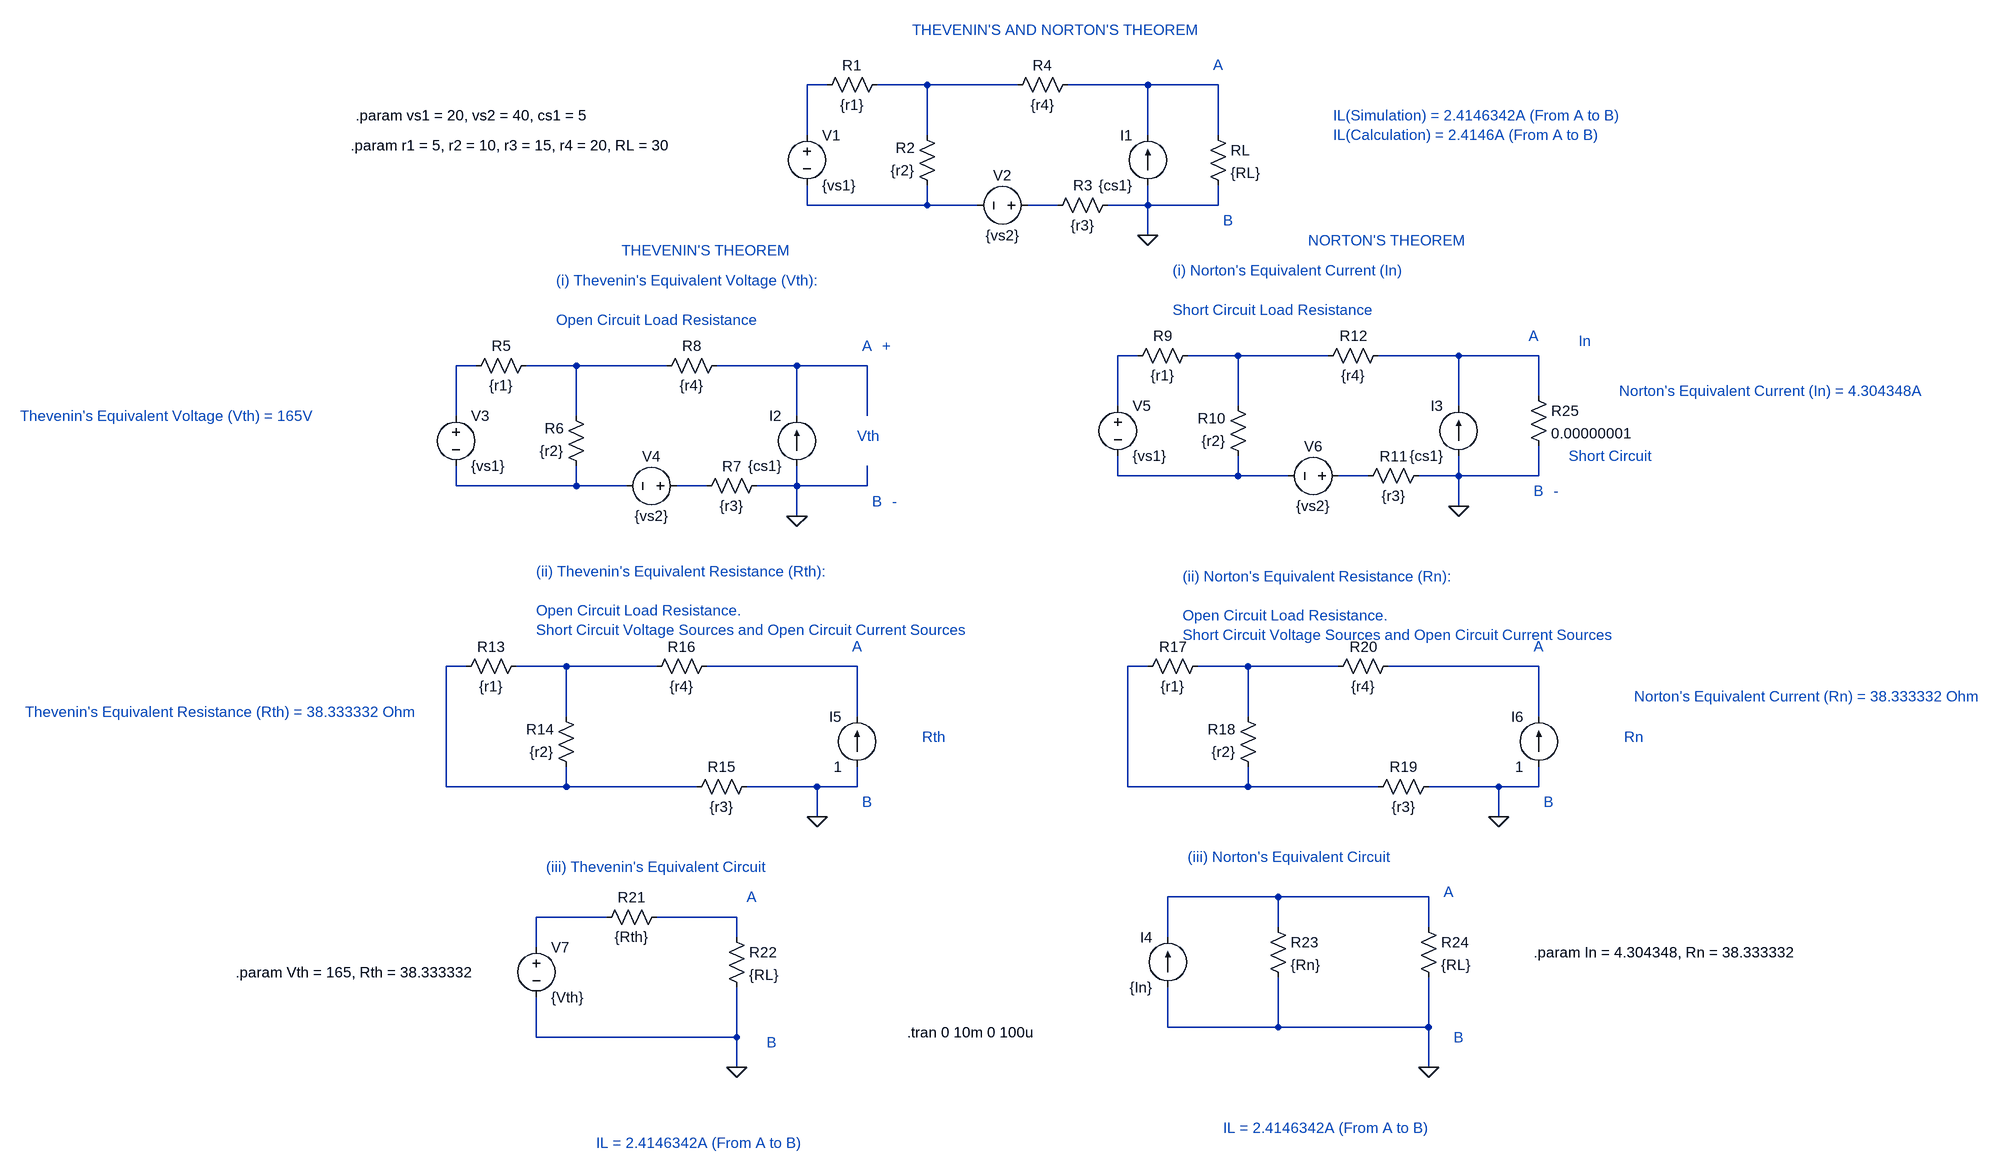
[diagram p0: schematic Thevenin's_Norton's_Theorem_2.asc]
Thevenin's_Norton's_Theorem_2.asc, the LTspice schematic file:
Version 4
SHEET 1 1732 1720
WIRE -160 16 -192 16
WIRE 0 16 -80 16
WIRE 144 16 0 16
WIRE 352 16 224 16
WIRE 464 16 352 16
WIRE -192 96 -192 16
WIRE 0 96 0 16
WIRE 352 96 352 16
WIRE 464 96 464 16
WIRE -192 208 -192 176
WIRE 0 208 0 176
WIRE 0 208 -192 208
WIRE 80 208 0 208
WIRE 208 208 160 208
WIRE 352 208 352 176
WIRE 352 208 288 208
WIRE 464 208 464 176
WIRE 464 208 352 208
WIRE 352 256 352 208
WIRE 336 448 304 448
WIRE 496 448 416 448
WIRE 640 448 496 448
WIRE 848 448 720 448
WIRE 976 448 848 448
WIRE -720 464 -752 464
WIRE -560 464 -640 464
WIRE -416 464 -560 464
WIRE -208 464 -336 464
WIRE -96 464 -208 464
WIRE 976 512 976 448
WIRE 304 528 304 448
WIRE 496 528 496 448
WIRE 848 528 848 448
WIRE -752 544 -752 464
WIRE -560 544 -560 464
WIRE -208 544 -208 464
WIRE -96 544 -96 464
WIRE 304 640 304 608
WIRE 496 640 496 608
WIRE 496 640 304 640
WIRE 576 640 496 640
WIRE 704 640 656 640
WIRE 848 640 848 608
WIRE 848 640 784 640
WIRE 976 640 976 592
WIRE 976 640 848 640
WIRE -752 656 -752 624
WIRE -560 656 -560 624
WIRE -560 656 -752 656
WIRE -480 656 -560 656
WIRE -352 656 -400 656
WIRE -208 656 -208 624
WIRE -208 656 -272 656
WIRE -96 656 -96 624
WIRE -96 656 -208 656
WIRE 848 688 848 640
WIRE -208 704 -208 656
WIRE -736 944 -768 944
WIRE -576 944 -656 944
WIRE -432 944 -576 944
WIRE -112 944 -352 944
WIRE 352 944 320 944
WIRE 512 944 432 944
WIRE 656 944 512 944
WIRE 976 944 736 944
WIRE -576 1024 -576 944
WIRE -112 1024 -112 944
WIRE 512 1024 512 944
WIRE 976 1024 976 944
WIRE -768 1136 -768 944
WIRE -576 1136 -576 1104
WIRE -576 1136 -768 1136
WIRE -368 1136 -576 1136
WIRE -176 1136 -288 1136
WIRE -112 1136 -112 1104
WIRE -112 1136 -176 1136
WIRE 320 1136 320 944
WIRE 512 1136 512 1104
WIRE 512 1136 320 1136
WIRE 720 1136 512 1136
WIRE 912 1136 800 1136
WIRE 976 1136 976 1104
WIRE 976 1136 912 1136
WIRE -176 1184 -176 1136
WIRE 912 1184 912 1136
WIRE 560 1312 384 1312
WIRE 800 1312 560 1312
WIRE -512 1344 -624 1344
WIRE -304 1344 -432 1344
WIRE 560 1360 560 1312
WIRE 800 1360 800 1312
WIRE -304 1376 -304 1344
WIRE 384 1376 384 1312
WIRE -624 1392 -624 1344
WIRE 384 1520 384 1456
WIRE 560 1520 560 1440
WIRE 560 1520 384 1520
WIRE 800 1520 800 1440
WIRE 800 1520 560 1520
WIRE -624 1536 -624 1472
WIRE -304 1536 -304 1456
WIRE -304 1536 -624 1536
WIRE -304 1584 -304 1536
WIRE 800 1584 800 1520
FLAG 352 256 0
FLAG -208 704 0
FLAG 848 688 0
FLAG -176 1184 0
FLAG 912 1184 0
FLAG -304 1584 0
FLAG 800 1584 0
SYMBOL voltage -192 80 R0
WINDOW 123 0 0 Left 0
WINDOW 39 0 0 Left 0
SYMATTR InstName V1
SYMATTR Value {vs1}
SYMBOL voltage 176 208 R90
WINDOW 0 -32 56 VBottom 2
WINDOW 3 32 56 VTop 2
WINDOW 123 0 0 Left 0
WINDOW 39 0 0 Left 0
SYMATTR InstName V2
SYMATTR Value {vs2}
SYMBOL current 352 176 R180
WINDOW 0 24 80 Left 2
WINDOW 3 24 0 Left 2
WINDOW 123 0 0 Left 0
WINDOW 39 0 0 Left 0
SYMATTR InstName I1
SYMATTR Value {cs1}
SYMBOL res -64 0 R90
WINDOW 0 0 56 VBottom 2
WINDOW 3 32 56 VTop 2
SYMATTR InstName R1
SYMATTR Value {r1}
SYMBOL res 16 192 R180
WINDOW 0 36 76 Left 2
WINDOW 3 36 40 Left 2
SYMATTR InstName R2
SYMATTR Value {r2}
SYMBOL res 192 224 R270
WINDOW 0 32 56 VTop 2
WINDOW 3 0 56 VBottom 2
SYMATTR InstName R3
SYMATTR Value {r3}
SYMBOL res 128 32 R270
WINDOW 0 32 56 VTop 2
WINDOW 3 0 56 VBottom 2
SYMATTR InstName R4
SYMATTR Value {r4}
SYMBOL res 448 80 R0
SYMATTR InstName RL
SYMATTR Value {RL}
SYMBOL voltage -752 528 R0
WINDOW 123 0 0 Left 0
WINDOW 39 0 0 Left 0
SYMATTR InstName V3
SYMATTR Value {vs1}
SYMBOL voltage -384 656 R90
WINDOW 0 -32 56 VBottom 2
WINDOW 3 32 56 VTop 2
WINDOW 123 0 0 Left 0
WINDOW 39 0 0 Left 0
SYMATTR InstName V4
SYMATTR Value {vs2}
SYMBOL current -208 624 R180
WINDOW 0 24 80 Left 2
WINDOW 3 24 0 Left 2
WINDOW 123 0 0 Left 0
WINDOW 39 0 0 Left 0
SYMATTR InstName I2
SYMATTR Value {cs1}
SYMBOL res -624 448 R90
WINDOW 0 0 56 VBottom 2
WINDOW 3 32 56 VTop 2
SYMATTR InstName R5
SYMATTR Value {r1}
SYMBOL res -544 640 R180
WINDOW 0 36 76 Left 2
WINDOW 3 36 40 Left 2
SYMATTR InstName R6
SYMATTR Value {r2}
SYMBOL res -368 672 R270
WINDOW 0 32 56 VTop 2
WINDOW 3 0 56 VBottom 2
SYMATTR InstName R7
SYMATTR Value {r3}
SYMBOL res -432 480 R270
WINDOW 0 32 56 VTop 2
WINDOW 3 0 56 VBottom 2
SYMATTR InstName R8
SYMATTR Value {r4}
SYMBOL voltage 304 512 R0
WINDOW 123 0 0 Left 0
WINDOW 39 0 0 Left 0
SYMATTR InstName V5
SYMATTR Value {vs1}
SYMBOL voltage 672 640 R90
WINDOW 0 -32 56 VBottom 2
WINDOW 3 32 56 VTop 2
WINDOW 123 0 0 Left 0
WINDOW 39 0 0 Left 0
SYMATTR InstName V6
SYMATTR Value {vs2}
SYMBOL current 848 608 R180
WINDOW 0 24 80 Left 2
WINDOW 3 24 0 Left 2
WINDOW 123 0 0 Left 0
WINDOW 39 0 0 Left 0
SYMATTR InstName I3
SYMATTR Value {cs1}
SYMBOL res 432 432 R90
WINDOW 0 0 56 VBottom 2
WINDOW 3 32 56 VTop 2
SYMATTR InstName R9
SYMATTR Value {r1}
SYMBOL res 512 624 R180
WINDOW 0 36 76 Left 2
WINDOW 3 36 40 Left 2
SYMATTR InstName R10
SYMATTR Value {r2}
SYMBOL res 688 656 R270
WINDOW 0 32 56 VTop 2
WINDOW 3 0 56 VBottom 2
SYMATTR InstName R11
SYMATTR Value {r3}
SYMBOL res 624 464 R270
WINDOW 0 32 56 VTop 2
WINDOW 3 0 56 VBottom 2
SYMATTR InstName R12
SYMATTR Value {r4}
SYMBOL res -640 928 R90
WINDOW 0 0 56 VBottom 2
WINDOW 3 32 56 VTop 2
SYMATTR InstName R13
SYMATTR Value {r1}
SYMBOL res -560 1120 R180
WINDOW 0 36 76 Left 2
WINDOW 3 36 40 Left 2
SYMATTR InstName R14
SYMATTR Value {r2}
SYMBOL res -384 1152 R270
WINDOW 0 32 56 VTop 2
WINDOW 3 0 56 VBottom 2
SYMATTR InstName R15
SYMATTR Value {r3}
SYMBOL res -448 960 R270
WINDOW 0 32 56 VTop 2
WINDOW 3 0 56 VBottom 2
SYMATTR InstName R16
SYMATTR Value {r4}
SYMBOL res 448 928 R90
WINDOW 0 0 56 VBottom 2
WINDOW 3 32 56 VTop 2
SYMATTR InstName R17
SYMATTR Value {r1}
SYMBOL res 528 1120 R180
WINDOW 0 36 76 Left 2
WINDOW 3 36 40 Left 2
SYMATTR InstName R18
SYMATTR Value {r2}
SYMBOL res 704 1152 R270
WINDOW 0 32 56 VTop 2
WINDOW 3 0 56 VBottom 2
SYMATTR InstName R19
SYMATTR Value {r3}
SYMBOL res 640 960 R270
WINDOW 0 32 56 VTop 2
WINDOW 3 0 56 VBottom 2
SYMATTR InstName R20
SYMATTR Value {r4}
SYMBOL voltage -624 1376 R0
WINDOW 123 0 0 Left 0
WINDOW 39 0 0 Left 0
SYMATTR InstName V7
SYMATTR Value {Vth}
SYMBOL res -416 1328 R90
WINDOW 0 0 56 VBottom 2
WINDOW 3 32 56 VTop 2
SYMATTR InstName R21
SYMATTR Value {Rth}
SYMBOL res -320 1360 R0
SYMATTR InstName R22
SYMATTR Value {RL}
SYMBOL current 384 1456 R180
WINDOW 0 24 80 Left 2
WINDOW 3 24 0 Left 2
WINDOW 123 0 0 Left 0
WINDOW 39 0 0 Left 0
SYMATTR InstName I4
SYMATTR Value {In}
SYMBOL res 544 1344 R0
SYMATTR InstName R23
SYMATTR Value {Rn}
SYMBOL res 784 1344 R0
SYMATTR InstName R24
SYMATTR Value {RL}
SYMBOL current -112 1104 R180
WINDOW 0 24 80 Left 2
WINDOW 3 24 0 Left 2
WINDOW 123 0 0 Left 0
WINDOW 39 0 0 Left 0
SYMATTR InstName I5
SYMATTR Value 1
SYMBOL current 976 1104 R180
WINDOW 0 24 80 Left 2
WINDOW 3 24 0 Left 2
WINDOW 123 0 0 Left 0
WINDOW 39 0 0 Left 0
SYMATTR InstName I6
SYMATTR Value 1
SYMBOL res 960 496 R0
SYMATTR InstName R25
SYMATTR Value 0.00000001
TEXT -24 -72 Left 2 ;THEVENIN'S AND NORTON'S THEOREM
TEXT -488 280 Left 2 ;THEVENIN'S THEOREM
TEXT 608 264 Left 2 ;NORTON'S THEOREM
TEXT -592 328 Left 2 ;(i) Thevenin's Equivalent Voltage (Vth):\n \nOpen Circuit Load Resistance
TEXT -624 792 Left 2 ;(ii) Thevenin's Equivalent Resistance (Rth):\n \nOpen Circuit Load Resistance.\nShort Circuit Voltage Sources and Open Circuit Current Sources
TEXT 392 312 Left 2 ;(i) Norton's Equivalent Current (In)\n \nShort Circuit Load Resistance
TEXT 408 800 Left 2 ;(ii) Norton's Equivalent Resistance (Rn):\n \nOpen Circuit Load Resistance.\nShort Circuit Voltage Sources and Open Circuit Current Sources
TEXT -608 1264 Left 2 ;(iii) Thevenin's Equivalent Circuit
TEXT 416 1248 Left 2 ;(iii) Norton's Equivalent Circuit
TEXT 456 -16 Left 2 ;A
TEXT 472 232 Left 2 ;B
TEXT -104 432 Left 2 ;A
TEXT -88 680 Left 2 ;B
TEXT -112 576 Left 2 ;Vth
TEXT -72 432 Left 2 ;+
TEXT -56 680 Left 2 ;-
TEXT 968 664 Left 2 ;B
TEXT 1000 664 Left 2 ;-
TEXT 960 416 Left 2 ;A
TEXT -120 912 Left 2 ;A
TEXT -104 1160 Left 2 ;B
TEXT -8 1056 Left 2 ;Rth
TEXT 968 912 Left 2 ;A
TEXT 984 1160 Left 2 ;B
TEXT 1112 1056 Left 2 ;Rn
TEXT -920 112 Left 2 !.param r1 = 5, r2 = 10, r3 = 15, r4 = 20, RL = 30
TEXT -912 64 Left 2 !.param vs1 = 20, vs2 = 40, cs1 = 5
TEXT -1104 1432 Left 2 !.param Vth = 165, Rth = 38.333332
TEXT 968 1400 Left 2 !.param In = 4.304348, Rn = 38.333332
TEXT 648 64 Left 2 ;IL(Simulation) = 2.4146342A (From A to B)\nIL(Calculation) = 2.4146A (From A to B)
TEXT -1448 544 Left 2 ;Thevenin's Equivalent Voltage (Vth) = 165V
TEXT -1440 1016 Left 2 ;Thevenin's Equivalent Resistance (Rth) = 38.333332 Ohm
TEXT 1104 504 Left 2 ;Norton's Equivalent Current (In) = 4.304348A
TEXT 1128 992 Left 2 ;Norton's Equivalent Current (Rn) = 38.333332 Ohm
TEXT -528 1704 Left 2 ;IL = 2.4146342A (From A to B)
TEXT 472 1680 Left 2 ;IL = 2.4146342A (From A to B)
TEXT 1040 424 Left 2 ;In
TEXT 1024 608 Left 2 ;Short Circuit
TEXT -32 1528 Left 2 !.tran 0 10m 0 100u
TEXT -288 1312 Left 2 ;A
TEXT -256 1544 Left 2 ;B
TEXT 824 1304 Left 2 ;A
TEXT 840 1536 Left 2 ;B

The netlist it stands for:
* Thevenin's_Norton's_Theorem_2.asc
V1 N001 N004 {vs1}
V2 N005 N004 {vs2}
I1 0 N003 {cs1}
R1 N002 N001 {r1}
R2 N004 N002 {r2}
R3 N005 0 {r3}
R4 N002 N003 {r4}
RL N003 0 {RL}
V3 N009 N014 {vs1}
V4 N015 N014 {vs2}
I2 0 N011 {cs1}
R5 N010 N009 {r1}
R6 N014 N010 {r2}
R7 N015 0 {r3}
R8 N010 N011 {r4}
V5 N006 N012 {vs1}
V6 N013 N012 {vs2}
I3 0 N008 {cs1}
R9 N007 N006 {r1}
R10 N012 N007 {r2}
R11 N013 0 {r3}
R12 N007 N008 {r4}
R13 N017 N016 {r1}
R14 N016 N017 {r2}
R15 N016 0 {r3}
R16 N017 N018 {r4}
R17 N020 N019 {r1}
R18 N019 N020 {r2}
R19 N019 0 {r3}
R20 N020 N021 {r4}
V7 N023 0 {Vth}
R21 N024 N023 {Rth}
R22 N024 0 {RL}
I4 0 N022 {In}
R23 N022 0 {Rn}
R24 N022 0 {RL}
I5 0 N018 1
I6 0 N021 1
R25 N008 0 0.00000001
* THEVENIN'S AND NORTON'S THEOREM
* THEVENIN'S THEOREM
* NORTON'S THEOREM
* (i) Thevenin's Equivalent Voltage (Vth):
* Open Circuit Load Resistance
* (ii) Thevenin's Equivalent Resistance (Rth):
* Open Circuit Load Resistance.
* Short Circuit Voltage Sources and Open Circuit Current Sources
* (i) Norton's Equivalent Current (In)
* Short Circuit Load Resistance
* (ii) Norton's Equivalent Resistance (Rn):
* Open Circuit Load Resistance.
* Short Circuit Voltage Sources and Open Circuit Current Sources
* (iii) Thevenin's Equivalent Circuit
* (iii) Norton's Equivalent Circuit
* A
* B
* A
* B
* Vth
* +
* -
* B
* -
* A
* A
* B
* Rth
* A
* B
* Rn
.param r1 = 5, r2 = 10, r3 = 15, r4 = 20, RL = 30
.param vs1 = 20, vs2 = 40, cs1 = 5
.param Vth = 165, Rth = 38.333332
.param In = 4.304348, Rn = 38.333332
* IL(Simulation) = 2.4146342A (From A to B)
* IL(Calculation) = 2.4146A (From A to B)
* Thevenin's Equivalent Voltage (Vth) = 165V
* Thevenin's Equivalent Resistance (Rth) = 38.333332 Ohm
* Norton's Equivalent Current (In) = 4.304348A
* Norton's Equivalent Current (Rn) = 38.333332 Ohm
* IL = 2.4146342A (From A to B)
* IL = 2.4146342A (From A to B)
* In
* Short Circuit
.tran 0 10m 0 100u
* A
* B
* A
* B
.backanno
.end